# EAGLE design sensores (EAGLE 9.2.2)
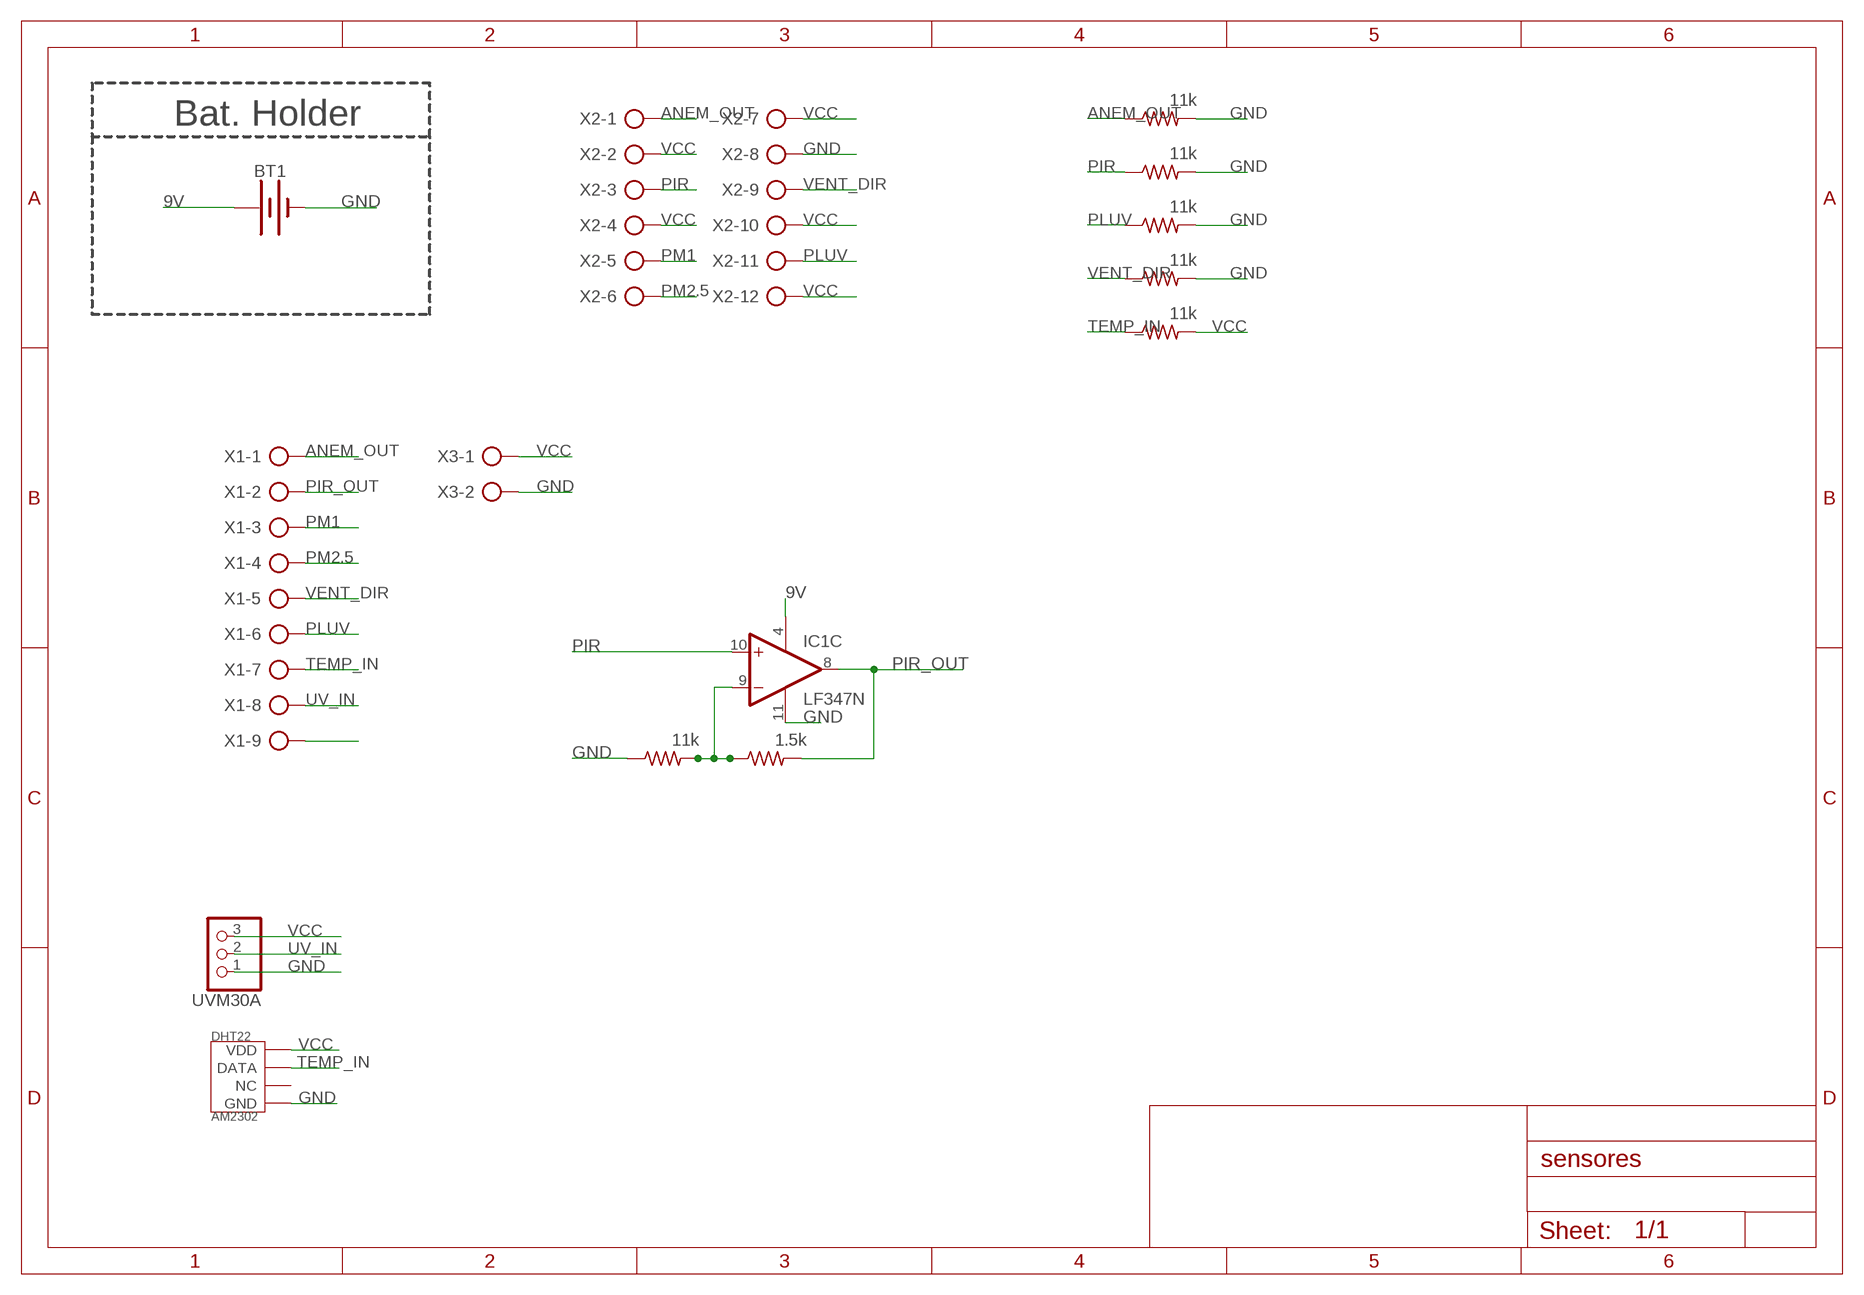
[diagram p0: schematic, sheet 1]

## Parts
BT1  BATTERY-9V  [BATTCON_9V]
DHT22  AM2302  TEM-HUM-AM2302(4P-25.0X15.0MM)  [SNR4-2.54-25.0X15.0X7.0MM]
IC1  LF347N  [DIL14]
R1  11k  R-US_0204/7  [0204/7]
R2  1.5k  R-US_0204/7  [0204/7]
R3  11k  R-US_0204/7  [0204/7]
R4  11k  R-US_0204/7  [0204/7]
R5  11k  R-US_0204/7  [0204/7]
R6  11k  R-US_0204/7  [0204/7]
R7  11k  R-US_0204/7  [0204/7]
UVM30A  PINHD-1X3/90  [1X03/90]
X1  AK500/9  [AK500/9]
X2  AK500/12  [AK500/12]
X3  AK500/2  [AK500/2]

## Nets
9V: BT1.+ IC1.4(P:V+)
ANEM_OUT: R3.1 X1.1 X2.1
GND: BT1.- DHT22.P$4(GND) IC1.11(P:V-) R1.1 R3.2 R4.2 R5.2 R6.2 UVM30A.1 X2.8 X3.2
N$6: IC1.9(C:-IN) R1.2 R2.1
N$21: X1.9
PIR: IC1.10(C:+IN) R4.1 X2.3
PIR_OUT: IC1.8(C:OUT) R2.2 X1.2
PLUV: R5.1 X1.6 X2.11
PM1: X1.3 X2.5
PM2.5: X1.4 X2.6
TEMP_IN: DHT22.P$2(DATA) R7.1 X1.7
UV_IN: UVM30A.2 X1.8
VCC: DHT22.P$1(VDD) R7.2 UVM30A.3 X2.2 X2.4 X2.7 X2.10 X2.12 X3.1
VENT_DIR: R6.1 X1.5 X2.9
Unconnected: DHT22.P$3(NC) IC1.1(A:OUT) IC1.2(A:-IN) IC1.3(A:+IN) IC1.5(B:+IN) IC1.6(B:-IN) IC1.7(B:OUT) IC1.12(D:+IN) IC1.13(D:-IN) IC1.14(D:OUT)

## Notes on the sheet
- Bat. Holder

## Library data of the parts
BT1 = SparkFun-Batteries:BATTERY: Battery - Single Cell A variety of battery chemistries, sizes, and footprints. Device List: 20MM_PTH - Coin Cell Battery Holder - 20mm (PTH) <https://www.sparkfun.com/products/783> 6.8MM_PTH - Coin Cell Battery Holder - 6.8MM(SMD) <https://www.digikey.com/product-detail/en/seiko-instruments/MS621FE-FL11E/728-1057-ND/1889208?WT.srch=1&gclid=CNOQ5a6LzdQCFZS2wAodXCkE0g> 12MM_SMD - Coin Cell Battery Holder - 12mm (SMD) <https://www.sparkfun.com/products/10592> 12MM_PTH - Coin Cell Battery Holder - 12mm (PTH) <https://www.sparkfun.com/products/7948> 20MM_SMD - 20mm Coin Cell Battery Holder (SMD) (2 legs) Used on the Big Time Watch Kit <https://www.sparkfun.com/products/11734> 20MM_SMD_4LEGS - Coin Cell Battery Holder - 20mm (SMD) <https://www.sparkfun.com/products/11892> 20MM_SMD_4LEGS_OVERPASTE - Coin Cell Battery Holder - 20mm (SMD) <https://www.sparkfun.com/products/11892> (Over-paste on the legs) 24.5MM_PTH - Coin Cell Battery Holder - 24.5mm (PTH) <https://www.sparkfun.com/products/8863> 9V - 9V Battery Holder - PC Mount Used on the SparkFun SparkPunk Sound Kit <https://www.sparkfun.com/products/11177> and SparkFun SparkPunk Sequencer Kit <https://www.sparkfun.com/products/12707> 18650 - Battery Holder - 18650 (PTH) <https://www.sparkfun.com/products/13113> AA - Battery Holder - 1xAA (PTH) <https://www.sparkfun.com/products/7949> AAA - Battery Holder - 1xAAA (PTH) <https://www.sparkfun.com/products/12718> AA_KIT - Battery Holder - 1xAA (PTH) <https://www.sparkfun.com/products/7949> Special kit package - pads only have exposed copper on one side of the board. AAA_KIT - Battery Holder - 1xAAA (PTH) <https://www.sparkfun.com/products/12718> Special kit package - pads only have exposed copper on one side of the board.; PROD_ID: BATT-10855
DHT22 = Seeed-Sensor:TEM-HUM-AM2302(4P-25.0X15.0MM): 314010001; MPN: AM2302
IC1 = linear:LF347: OP AMP
R1-R7 = adafruit:R-US_: RESISTOR, American symbol
UVM30A = pinhead:PINHD-1X3: PIN HEADER
X1 = con-ptr500:AK500/9: CONNECTOR; OC_FARNELL: unknown; OC_NEWARK: unknown
X2 = con-ptr500:AK500/12: CONNECTOR; OC_FARNELL: unknown; OC_NEWARK: unknown
X3 = con-ptr500:AK500/2: CONNECTOR; OC_FARNELL: unknown; OC_NEWARK: unknown

## Board
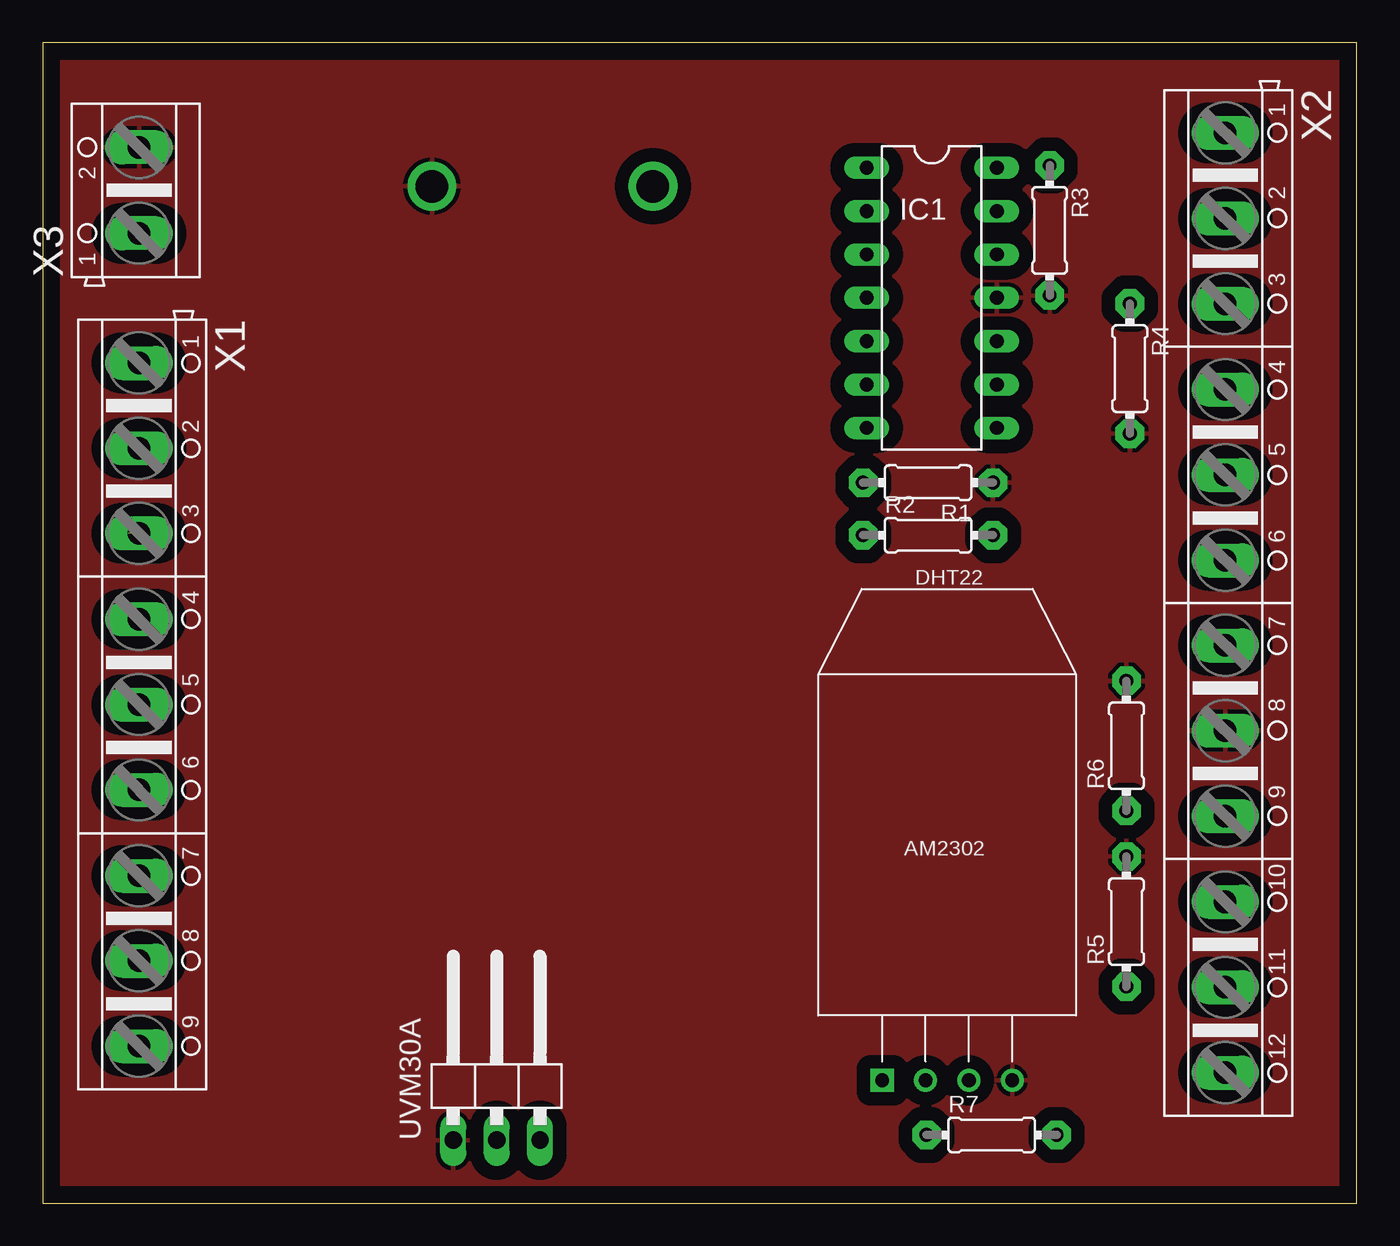
[diagram p1: board, top side]
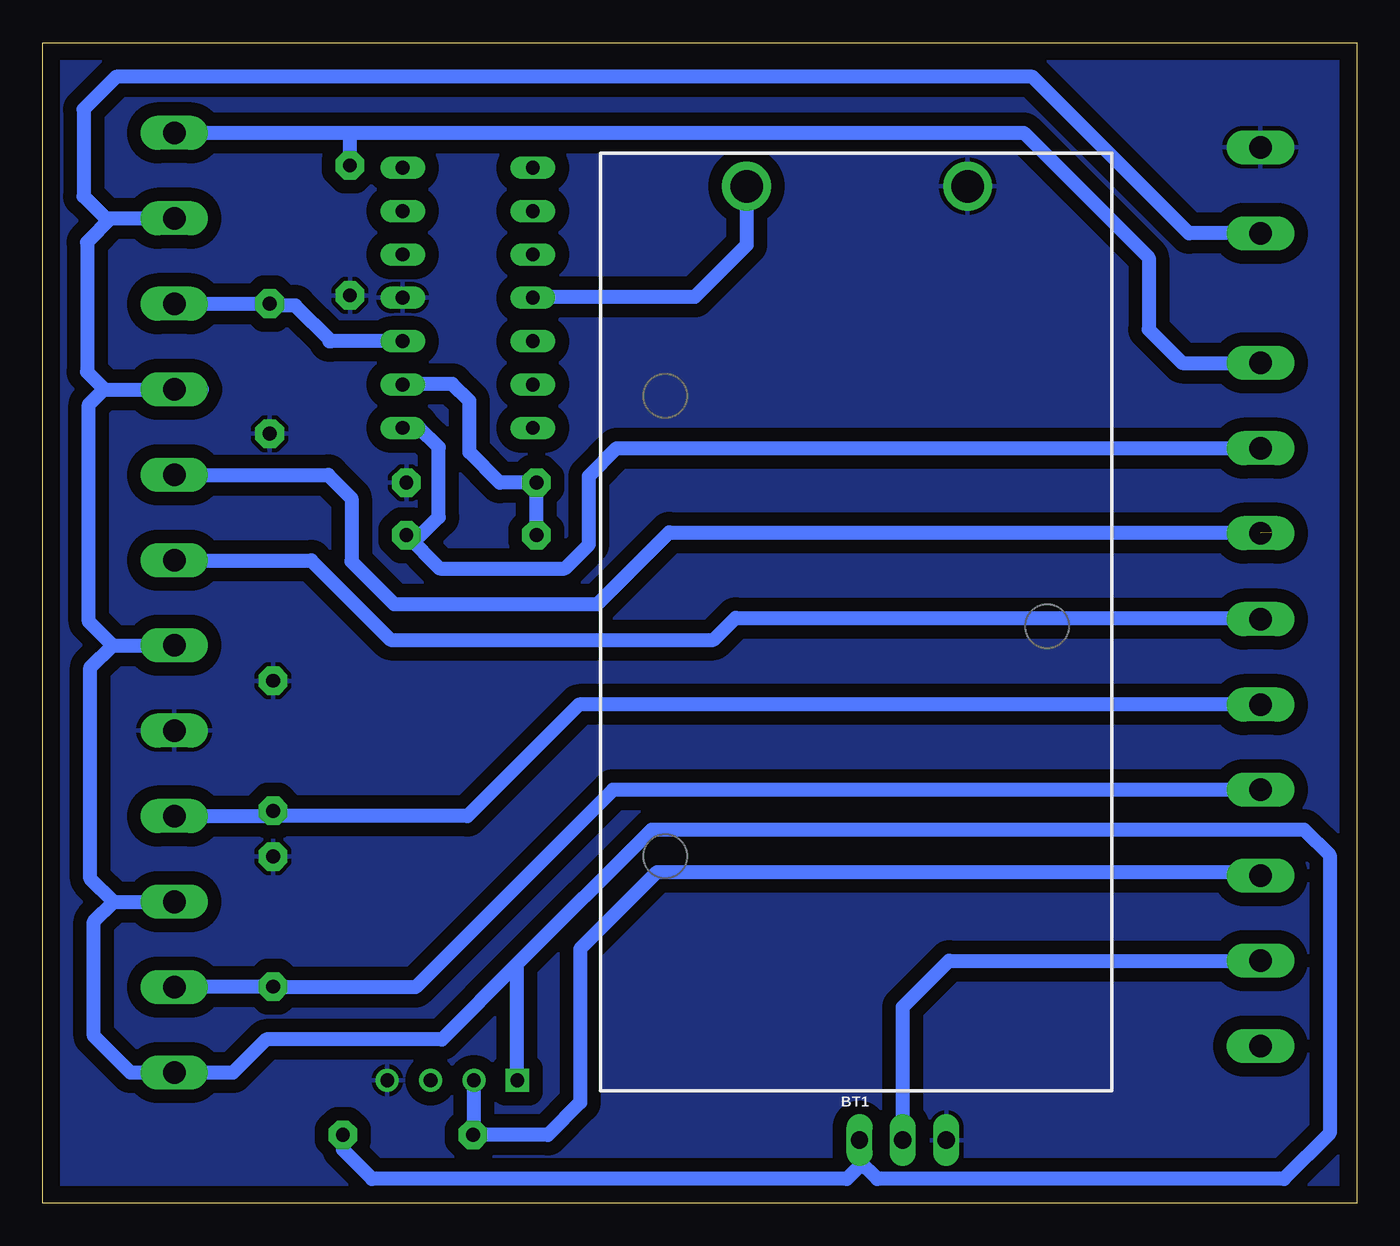
[diagram p2: board, bottom side, seen from below]

Size 77 x 68 mm. Coordinates in mm from the lower left corner, seen from the top.
Outline: 0,0 77,0 77,68 0,68 0,0
Copper layers (1*16): Top 0.035mm / dielectric 1.5mm / Bottom 0.035mm
Design rules "default": minimum track width 6mil, minimum drill 0.35mm, track to track 6mil, track to pad 6mil, pad to pad 6mil, via to via 6mil, smd to smd 6mil, copper to edge 40mil, drill to drill 6mil, minimum pad ring 10mil, minimum via ring 8mil, stop-mask expansion 4mil, vias tented up to drill 0mil, thermal gap 10mil

### Footprints (pad centres in the part's own frame; a part is rotated, then mirrored left to right if it is on the bottom)
BATTCON_9V = drill 1.905: + 0,0; - 0,-12.954
SNR4-2.54-25.0X15.0X7.0MM = drill 0.8 pad 1.35 square: P$1 -3.81,-13.8 | drill 0.8 pad 1.35: P$2 -1.27,-13.8; P$3 1.27,-13.8; P$4 3.81,-13.8
DIL14 = drill 0.813 long: 1 -7.62,-3.81; 2 -5.08,-3.81; 3 -2.54,-3.81; 4 0,-3.81; 5 2.54,-3.81; 6 5.08,-3.81; 7 7.62,-3.81; 8 7.62,3.81; 9 5.08,3.81; 10 2.54,3.81; 11 0,3.81; 12 -2.54,3.81; 13 -5.08,3.81; 14 -7.62,3.81
0204/7 = drill 0.813 pad 1.676 octagon: 1 -3.81,0; 2 3.81,0
1X03/90 = drill 1.016 long: 1 -2.54,-3.81; 2 0,-3.81; 3 2.54,-3.81
AK500/9 = drill 1.321 long: 1 -20.015,0; 2 -15.011,0; 3 -10.033,0; 4 -5.004,0; 5 0,0; 6 5.004,0; 7 10.033,0; 8 15.011,0; 9 20.015,0
AK500/12 = drill 1.321 long: 1 -27.534,0; 2 -22.53,0; 3 -17.526,0; 4 -12.497,0; 5 -7.493,0; 6 -2.489,0; 7 2.489,0; 8 7.493,0; 9 12.497,0; 10 17.526,0; 11 22.53,0; 12 27.534,0
AK500/2 = drill 1.321 long: 1 -2.515,0; 2 2.515,0

### Placement (x,y rotation side)
BT1  35.76,59.59 90 bottom
DHT22  53,21 0 top
IC1  52.09,53.05 270 top
R1  51.88,42.22 180 top
R2  51.88,39.14 0 top
R3  59,57 270 top
R4  63.7,48.9 270 top
R5  63.5,16.5 90 top
R6  63.5,26.8 90 top
R7  55.6,4 0 top
UVM30A  26.6,7.5 0 top
X1  5.64,29.22 270 top
X2  69.29,35.18 270 top
X3  5.65,59.35 90 top

### Tracks (layer width: path | path; a pad name or v marks a point on that pad's centre or on a via)
9V
  Bottom 0.813: BT1.+ 35.76,56.14 38.8,53.1 48.23,53.1 IC1.4
ANEM_OUT
  Bottom 0.813: X2.1 59,62.71 | 59,62.71 19.51,62.71 12.2,55.4 12.2,51.2 10.23,49.23 X1.1 | R3.1 59,62.71
GND
  pour Top (isolate 0.8): 0,0 77.02,0 77.02,68.03 0,68.03
  pour Bottom (isolate 0.8): 0,0 77,0 77,68 0,68
N$6
  Bottom 0.813: R2.1 R1.2 50.22,42.22 52,44 52,47 53,48 55.87,48 IC1.9
PIR
  Bottom 0.813: IC1.10 60.11,50.51 | 60.11,50.51 60.21,50.51 | 60.11,50.51 62.2,52.6 63.59,52.6 R4.1 | R4.1 | X2.3 R4.1
PIR_OUT
  Bottom 0.813: IC1.8 54.93,45.43 53.8,44.3 53.8,40.2 54.86,39.14 R2.2 53.75,37.2 46.4,37.2 45,38.6 45,42.6 43.37,44.23 X1.2
PLUV
  Bottom 0.813: X1.6 43.58,24.22 55.15,12.65 63.46,12.65 R5.1 69.25,12.69 X2.11
PM1  (1 unrouted)
  Bottom 0.813: X2.5 60.27,42.67 58.9,41.3 58.9,37.6 56.4,35.1 44.5,35.1 40.3,39.3 5,39.3
PM2.5
  Bottom 0.813: X2.6 61.27,37.67 56.6,33 37.7,33 36.4,34.3 5.72,34.3 X1.4
TEMP_IN
  Bottom 0.813: X1.7 5.85,19.4 41,19.4 45.5,14.9 45.5,5.9 47.4,4 R7.1 51.73,4.06 DHT22.P$2
UV_IN
  Bottom 0.813: UVM30A.2 26.6,11.5 23.9,14.2 X1.8
VCC
  Bottom 0.813: X3.1 9.84,56.84 19,66 72.7,66 74.6,64.1 74.6,59 73.31,57.71 73,57.71 | 67.68,47.68 X2.4 73.38,47.68 | 72.85,17.65 X2.10 | 72.85,17.65 74,16.5 74,9.8 71.85,7.65 X2.12 65.85,7.65 63.9,9.6 53.6,9.6 49.19,14.01 | 72.85,17.65 74.2,19.01 74.2,31.4 72.91,32.69 | 72.91,32.69 X2.7 | 72.91,32.69 74.3,34.08 74.3,46.8 73.42,47.68 73.38,47.68 | 73,57.71 X2.2 | 73,57.71 74.4,56.31 74.4,48.7 73.38,47.68 | DHT22.P$1 49.19,14.01 | 49.19,14.01 41.3,21.9 3.1,21.9 1.6,20.4 1.6,4.1 4.28,1.42 28.1,1.42 29.14,2.46 UVM30A.3 29.14,2.16 29.88,1.42 57.7,1.42 59.41,3.13 R7.2
VENT_DIR
  Bottom 0.813: X1.5 45.58,29.22 52.12,22.68 63.19,22.68 R6.1 63.81,22.68 X2.9